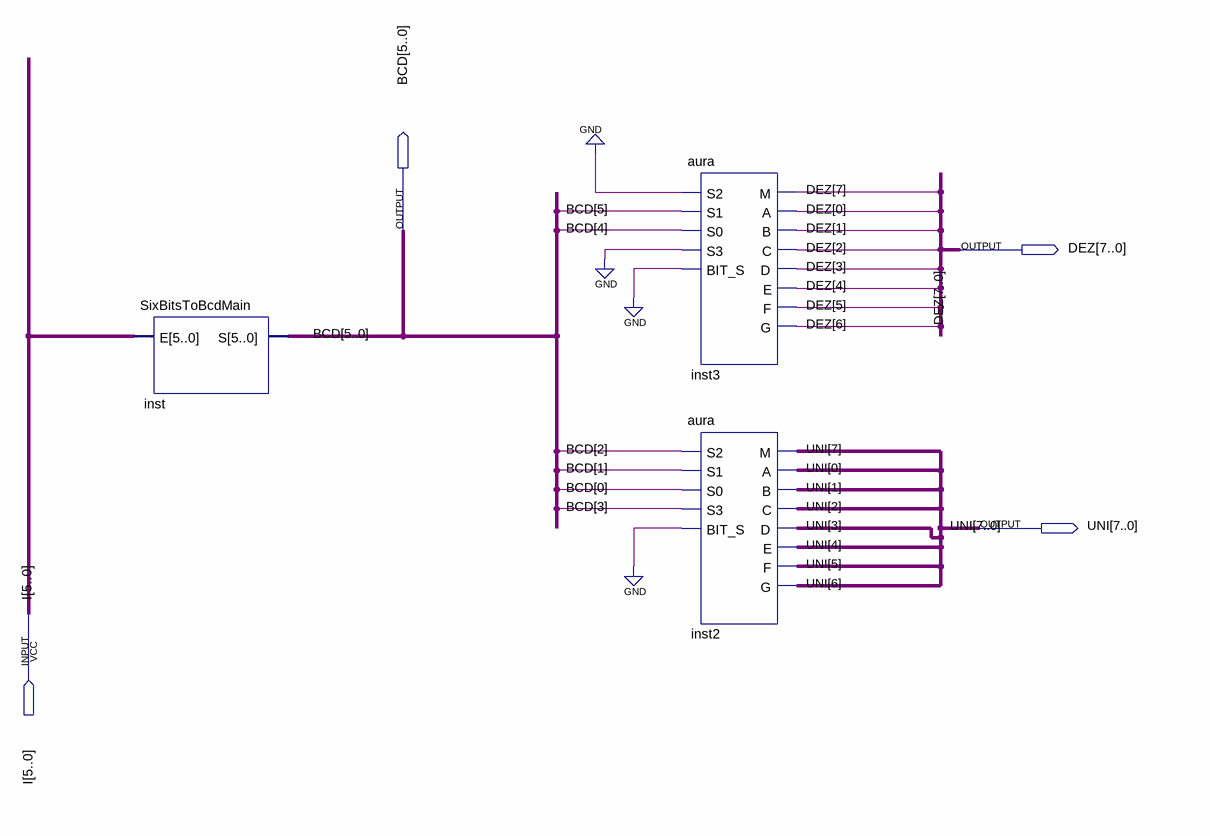
[diagram p0: schematic sheet]
// Quartus schematic teste.bdf as structural Verilog: 3 symbols, 4 pins
module teste (
  input  [5:0] I,
  output [5:0] BCD,
  output [7:0] DEZ,
  output [7:0] UNI
);

  SixBitsToBcdMain inst (.E(I), .S(BCD));
  aura inst3 (
    .S2(1'b0), .S1(BCD[5]), .S0(BCD[4]), .S3(1'b0), .BIT_S(1'b0), .M(DEZ[7]), .A(DEZ[0]), .B(DEZ[1]),
    .C(DEZ[2]), .D(DEZ[3]), .E(DEZ[4]), .F(DEZ[5]), .G(DEZ[6]));
  aura inst2 (
    .S2(BCD[2]), .S1(BCD[1]), .S0(BCD[0]), .S3(BCD[3]), .BIT_S(1'b0), .M(UNI[7]), .A(UNI[0]), .B(UNI[1]),
    .C(UNI[2]), .D(UNI[3]), .E(UNI[4]), .F(UNI[5]), .G(UNI[6]));
endmodule
